# EAGLE schematic main (EAGLE 7.6.0)
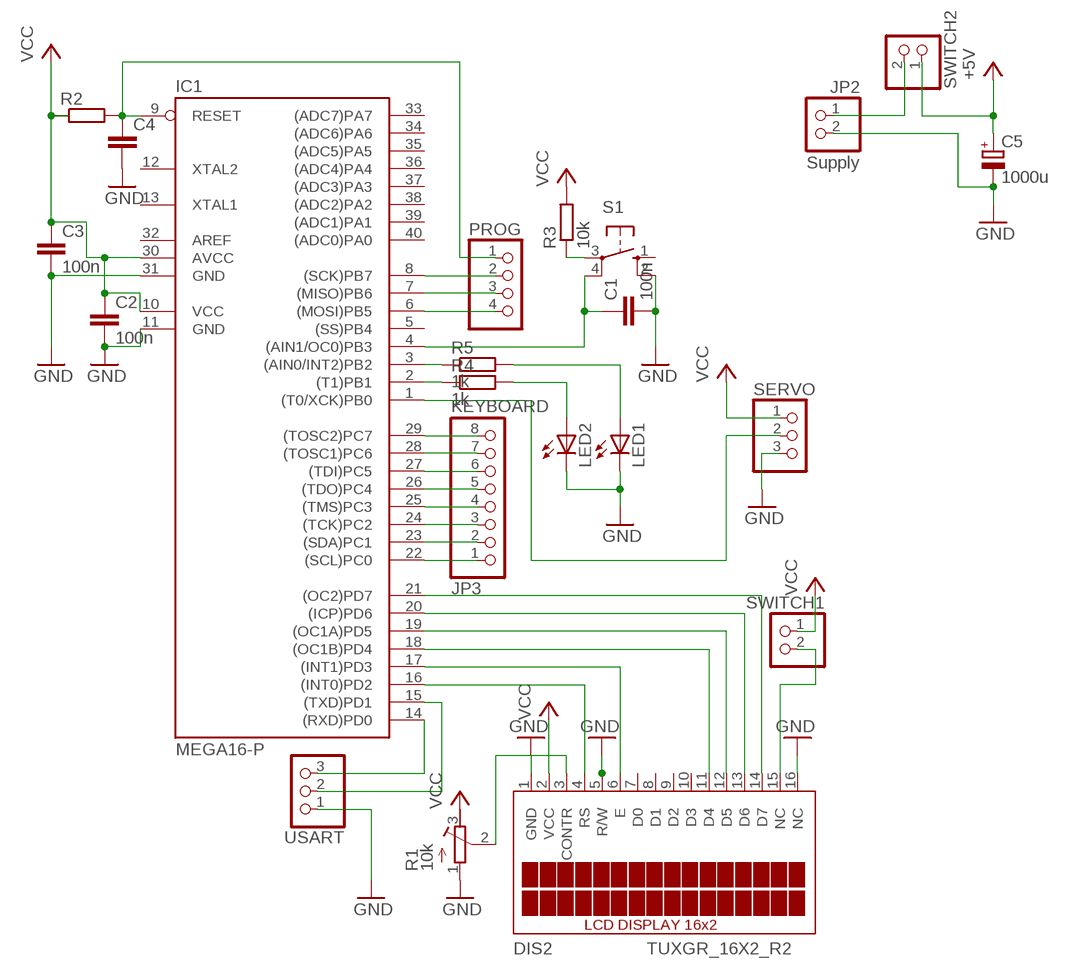
[diagram p0: schematic, sheet 1]

## Parts
C1  100n  C-EU025-025X050  [C025-025X050]
C2  100n  C-EU025-025X050  [C025-025X050]
C3  100n  C-EU025-025X050  [C025-025X050]
C4  C-EU025-025X050  [C025-025X050]
C5  1000u  CPOL-EUE2.5-7  [E2,5-7]
DIS2  TUXGR_16X2_R2  [TUXGR_16X2_R2]
IC1  MEGA16-P  [DIL40]
JP2  Supply  PINHD-1X2  [1X02]
JP3  KEYBOARD  PINHD-1X8  [1X08]
LED1  LED5MM  [LED5MM]
LED2  LED5MM  [LED5MM]
PROG  PINHD-1X4  [1X04]
R1  10k  R-TRIMM4G/J  [RTRIM4G/J]
R2  R-EU_0204/7  [0204/7]
R3  10k  R-EU_0204/7  [0204/7]
R4  1k  R-EU_0204/7  [0204/7]
R5  1k  R-EU_0204/7  [0204/7]
S1  10-XX  [B3F-10XX]
SERVO  PINHD-1X3  [1X03]
SWITCH1  PINHD-1X2  [1X02]
SWITCH2  PINHD-1X2  [1X02]
USART  PINHD-1X3  [1X03]

## Nets
GND: C1.2 C2.2 C3.2 C4.2 C5.- DIS2.1(GND) DIS2.5(R/W) DIS2.16(NC) IC1.11(GND) IC1.31(GND) JP2.2 LED1.K(C) LED2.K(C) R1.1(A) S1.2(S1) SERVO.3 USART.1
N$1: C4.1 IC1.9(RESET) PROG.1 R2.2
N$2: DIS2.14(D7) IC1.21((OC2)PD7)
N$3: DIS2.13(D6) IC1.20((ICP)PD6)
N$4: DIS2.12(D5) IC1.19((OC1A)PD5)
N$5: DIS2.11(D4) IC1.18((OC1B)PD4)
N$6: DIS2.4(RS) IC1.16((INT0)PD2)
N$7: DIS2.6(E) IC1.17((INT1)PD3)
N$8: DIS2.3(CONTR) R1.2(S)
N$9: IC1.2((T1)PB1) R4.1
N$10: IC1.3((AIN0/INT2)PB2) R5.1
N$11: LED2.A R4.2
N$12: LED1.A R5.2
N$13: IC1.6((MOSI)PB5) PROG.4
N$14: C1.1 IC1.4((AIN1/OC0)PB3) S1.4(P1)
N$15: JP2.1 SWITCH2.2
N$16: R3.1 S1.3(P)
N$17: DIS2.15(NC) SWITCH1.2
N$18: IC1.7((MISO)PB6) PROG.3
N$19: IC1.8((SCK)PB7) PROG.2
N$20: IC1.14((RXD)PD0) USART.3
N$21: IC1.15((TXD)PD1) USART.2
N$22: IC1.29((TOSC2)PC7) JP3.8
N$23: IC1.28((TOSC1)PC6) JP3.7
N$24: IC1.27((TDI)PC5) JP3.6
N$25: IC1.26((TDO)PC4) JP3.5
N$26: IC1.25((TMS)PC3) JP3.4
N$27: IC1.24((TCK)PC2) JP3.3
N$28: IC1.23((SDA)PC1) JP3.2
N$29: IC1.22((SCL)PC0) JP3.1
N$30: IC1.1((T0/XCK)PB0) SERVO.2
VCC: C2.1 C3.1 C5.+ DIS2.2(VCC) IC1.10(VCC) IC1.30(AVCC) R1.3(E) R2.1 R3.2 SWITCH1.1 SWITCH2.1 ; supply symbol labelled +5V
Unconnected: DIS2.7(D0) DIS2.8(D1) DIS2.9(D2) DIS2.10(D3) IC1.5((SS)PB4) IC1.12(XTAL2) IC1.13(XTAL1) IC1.32(AREF) IC1.33((ADC7)PA7) IC1.34((ADC6)PA6) IC1.35((ADC5)PA5) IC1.36((ADC4)PA4) IC1.37((ADC3)PA3) IC1.38((ADC2)PA2) IC1.39((ADC1)PA1) IC1.40((ADC0)PA0) S1.1(S) SERVO.1

## Library data of the parts
C1-C4 = rcl:C-EU: CAPACITOR, European symbol
C5 = rcl:CPOL-EU: POLARIZED CAPACITOR, European symbol
DIS2 = display-lcd:TUXGR_16X2_R2: Tuxgraphics LCD display 16x2 characters reflective, without background light Source: tuxgr_12x2_r2.pdf; OC_FARNELL: unknown; OC_NEWARK: unknown
IC1 = atmel:MEGA16-P: MICROCONTROLLER 16 Kbytes FLASH 1 kbytes SRAM 512 bytes EEPROM USART 8-channel 10 bit ADC Source: avr.lbr; MPN: ATMEGA16-16PU; OC_FARNELL: 9171142; OC_NEWARK: 01M6885
JP2 SWITCH1 SWITCH2 = pinhead:PINHD-1X2: PIN HEADER
JP3 = pinhead:PINHD-1X8: PIN HEADER
LED1 LED2 = led:LED: LED OSRAM: - CHIPLED LG R971, LG N971, LY N971, LG Q971, LY Q971, LO R971, LY R971 LH N974, LH R974 LS Q976, LO Q976, LY Q976 LO Q996 - Hyper CHIPLED LW Q18S LB Q993, LB Q99A, LB R99A - SideLED LS A670, LO A670, LY A670, LG A670, LP A670 LB A673, LV A673, LT A673, LW A673 LH A674 LY A675 LS A676, LA A676, LO A676, LY A676, LW A676 LS A679, LY A679, LG A679 - Hyper Micro SIDELED® LS Y876, LA Y876, LO Y876, LY Y876 LT Y87S - SmartLED LW L88C, LW L88S LB L89C, LB L89S, LG L890 LS L89K, LO L89K, LY L89K LS L896, LA L896, LO L896, LY L896 - TOPLED LS T670, LO T670, LY T670, LG T670, LP T670 LSG T670, LSP T670, LSY T670, LOP T670, LYG T670 LG T671, LOG T671, LSG T671 LB T673, LV T673, LT T673, LW T673 LH T674 LS T676, LA T676, LO T676, LY T676, LB T676, LH T676, LSB T676, LW T676 LB T67C, LV T67C, LT T67C, LS T67K, LO T67K, LY T67K, LW E67C LS E67B, LA E67B, LO E67B, LY E67B, LB E67C, LV E67C, LT E67C LW T67C LS T679, LY T679, LG T679 LS T770, LO T770, LY T770, LG T770, LP T770 LB T773, LV T773, LT T773, LW T773 LH T774 LS E675, LA E675, LY E675, LS T675 LS T776, LA T776, LO T776, LY T776, LB T776 LHGB T686 LT T68C, LB T68C - Hyper Mini TOPLED® LB M676 - Mini TOPLED Santana® LG M470 LS M47K, LO M47K, LY M47K Source: http://www.osram.convergy.de LUXEON: - LUMILED® LXK2-PW12-R00, LXK2-PW12-S00, LXK2-PW14-U00, LXK2-PW14-V00 LXK2-PM12-R00, LXK2-PM12-S00, LXK2-PM14-U00 LXK2-PE12-Q00, LXK2-PE12-R00, LXK2-PE12-S00, LXK2-PE14-T00, LXK2-PE14-U00 LXK2-PB12-K00, LXK2-PB12-L00, LXK2-PB12-M00, LXK2-PB14-N00, LXK2-PB14-P00, LXK2-PB14-Q00 LXK2-PR12-L00, LXK2-PR12-M00, LXK2-PR14-Q00, LXK2-PR14-R00 LXK2-PD12-Q00, LXK2-PD12-R00, LXK2-PD12-S00 LXK2-PH12-R00, LXK2-PH12-S00 LXK2-PL12-P00, LXK2-PL12-Q00, LXK2-PL12-R00 Source: www.luxeon.com KINGBRIGHT: KA-3528ASYC Source: www.kingbright.com
PROG = pinhead:PINHD-1X4: PIN HEADER
R1 = rcl:R-TRIMM: Trimm resistor
R2-R5 = rcl:R-EU_: RESISTOR, European symbol
S1 = switch-omron:10-XX: OMRON SWITCH; MPN: B3F-1000; OC_FARNELL: 176432; OC_NEWARK: 36M3542
SERVO USART = pinhead:PINHD-1X3: PIN HEADER